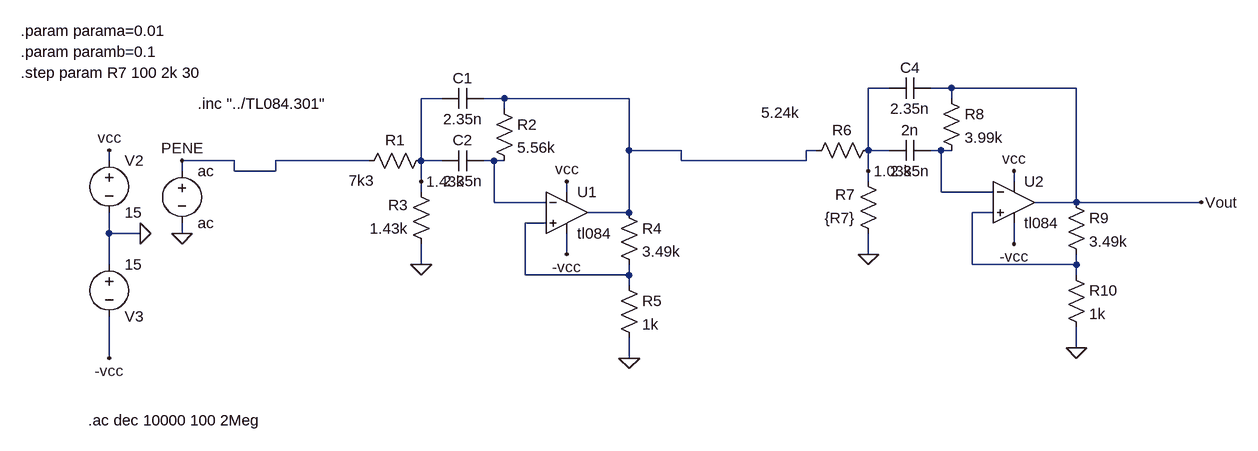
[diagram p0: schematic Celda Sedra sin pote.asc]
Celda Sedra sin pote.asc, the LTspice schematic file:
Version 4
SHEET 1 1648 680
WIRE 1024 -80 992 -80
WIRE 1120 -80 1088 -80
WIRE 1312 -80 1120 -80
WIRE 336 -64 304 -64
WIRE 432 -64 400 -64
WIRE 624 -64 432 -64
WIRE 1120 -64 1120 -80
WIRE 432 -48 432 -64
WIRE 624 16 624 -64
WIRE 704 16 624 16
WIRE 912 16 896 16
WIRE 992 16 992 -80
WIRE 1024 16 992 16
WIRE 1104 16 1088 16
WIRE 1120 16 1104 16
WIRE -176 32 -176 16
WIRE 16 32 -64 32
WIRE 224 32 80 32
WIRE 304 32 304 -64
WIRE 336 32 304 32
WIRE 416 32 400 32
WIRE 432 32 416 32
WIRE 704 32 704 16
WIRE 896 32 896 16
WIRE 896 32 704 32
WIRE -64 48 -64 32
WIRE 16 48 16 32
WIRE 80 48 80 32
WIRE 80 48 16 48
WIRE 992 48 992 16
WIRE 304 64 304 32
WIRE 992 64 992 48
WIRE 1216 64 1216 48
WIRE 304 80 304 64
WIRE 528 80 528 64
WIRE 1104 80 1104 16
WIRE 1184 80 1104 80
WIRE 416 96 416 32
WIRE 496 96 416 96
WIRE 1312 96 1312 -80
WIRE 1312 96 1248 96
WIRE 1504 96 1312 96
WIRE 624 112 624 16
WIRE 624 112 560 112
WIRE 1184 112 1152 112
WIRE 496 128 464 128
WIRE -176 144 -176 112
WIRE -128 144 -176 144
WIRE -64 144 -64 128
WIRE 1216 160 1216 128
WIRE 528 176 528 144
WIRE 992 176 992 144
WIRE -176 192 -176 144
WIRE 304 192 304 160
WIRE 1152 192 1152 112
WIRE 1312 192 1312 176
WIRE 1312 192 1152 192
WIRE 464 208 464 128
WIRE 624 208 624 192
WIRE 624 208 464 208
WIRE 1312 208 1312 192
WIRE 624 224 624 208
WIRE 1312 320 1312 288
WIRE -176 336 -176 272
WIRE 624 336 624 304
FLAG -128 144 0
FLAG -176 16 vcc
FLAG -176 336 -vcc
FLAG 528 64 vcc
FLAG 528 176 -vcc
FLAG -64 144 0
FLAG 624 336 0
FLAG 304 192 0
FLAG -64 32 PENE
FLAG 1216 48 vcc
FLAG 1216 160 -vcc
FLAG 1312 320 0
FLAG 992 176 0
FLAG 1504 96 Vout
FLAG 304 64 1.43k
FLAG 992 48 1.03k
SYMBOL Opamps\\opamp2 528 48 R0
SYMATTR InstName U1
SYMATTR Value tl084
SYMBOL voltage -176 16 R0
WINDOW 123 0 0 Left 0
WINDOW 39 0 0 Left 0
SYMATTR InstName V2
SYMATTR Value 15
SYMBOL voltage -176 176 R0
WINDOW 0 24 96 Left 2
WINDOW 3 24 16 Left 2
WINDOW 123 0 0 Left 0
WINDOW 39 0 0 Left 0
SYMATTR InstName V3
SYMATTR Value 15
SYMBOL voltage -64 32 R0
WINDOW 123 0 0 Left 0
WINDOW 39 0 0 Left 0
SYMATTR InstName ac
SYMATTR Value ac
SYMBOL res 320 16 R90
WINDOW 0 0 56 VBottom 2
WINDOW 3 31 108 VTop 2
SYMATTR InstName R1
SYMATTR Value 7k3
SYMBOL res 320 176 R180
WINDOW 0 36 76 Left 2
WINDOW 3 36 40 Left 2
SYMATTR InstName R3
SYMATTR Value 1.43k
SYMBOL cap 400 16 R90
WINDOW 0 0 32 VBottom 2
WINDOW 3 32 32 VTop 2
SYMATTR InstName C2
SYMATTR Value 2.35n
SYMBOL res 416 -64 R0
SYMATTR InstName R2
SYMATTR Value 5.56k
SYMBOL cap 400 -80 R90
WINDOW 0 0 32 VBottom 2
WINDOW 3 32 32 VTop 2
SYMATTR InstName C1
SYMATTR Value 2.35n
SYMBOL res 608 96 R0
SYMATTR InstName R4
SYMATTR Value 3.49k
SYMBOL res 608 208 R0
SYMATTR InstName R5
SYMATTR Value 1k
SYMBOL Opamps\\opamp2 1216 32 R0
SYMATTR InstName U2
SYMATTR Value tl084
SYMBOL res 1008 0 R90
WINDOW 0 0 56 VBottom 2
WINDOW 3 -58 151 VTop 2
SYMATTR InstName R6
SYMATTR Value 5.24k
SYMBOL res 1008 160 R180
WINDOW 0 36 76 Left 2
WINDOW 3 36 40 Left 2
SYMATTR InstName R7
SYMATTR Value {R7}
SYMBOL cap 1088 0 R90
WINDOW 0 0 32 VBottom 2
WINDOW 3 32 32 VTop 2
SYMATTR InstName 2n
SYMATTR Value 2.35n
SYMBOL res 1104 -80 R0
SYMATTR InstName R8
SYMATTR Value 3.99k
SYMBOL cap 1088 -96 R90
WINDOW 0 0 32 VBottom 2
WINDOW 3 32 32 VTop 2
SYMATTR InstName C4
SYMATTR Value 2.35n
SYMBOL res 1296 80 R0
SYMATTR InstName R9
SYMATTR Value 3.49k
SYMBOL res 1296 192 R0
SYMATTR InstName R10
SYMATTR Value 1k
TEXT -208 432 Left 2 !.ac dec 10000 100 2Meg
TEXT -312 -168 Left 2 !.param parama=0.01
TEXT -312 -136 Left 2 !.param paramb=0.1
TEXT -312 -104 Left 2 !.step param R7 100 2k 30
TEXT -40 -56 Left 2 !.inc "../TL084.301"

The netlist it stands for:
* Celda Sedra sin pote.asc
XU1 N005 N003 vcc -vcc N001 tl084  ; pins In+ In- V+ V- OUT
V2 vcc 0 15
V3 0 -vcc 15
V§ac PENE 0 ac
R1 1.43k PENE 7k3
R3 0 1.43k 1.43k
C2 N003 1.43k 2.35n
R2 N001 N003 5.56k
C1 N001 1.43k 2.35n
R4 N001 N005 3.49k
R5 N005 0 1k
XU2 N004 N002 vcc -vcc Vout tl084  ; pins In+ In- V+ V- OUT
R6 1.03k N001 5.24k
R7 0 1.03k {R7}
C§2n N002 1.03k 2.35n
R8 Vout N002 3.99k
C4 Vout 1.03k 2.35n
R9 Vout N004 3.49k
R10 N004 0 1k
.ac dec 10000 100 2Meg
.param parama=0.01
.param paramb=0.1
.step param R7 100 2k 30
.inc "../TL084.301"
.backanno
.end